# EAGLE design ETAG (EAGLE 8.0.0)

## Sheet 1 of 2
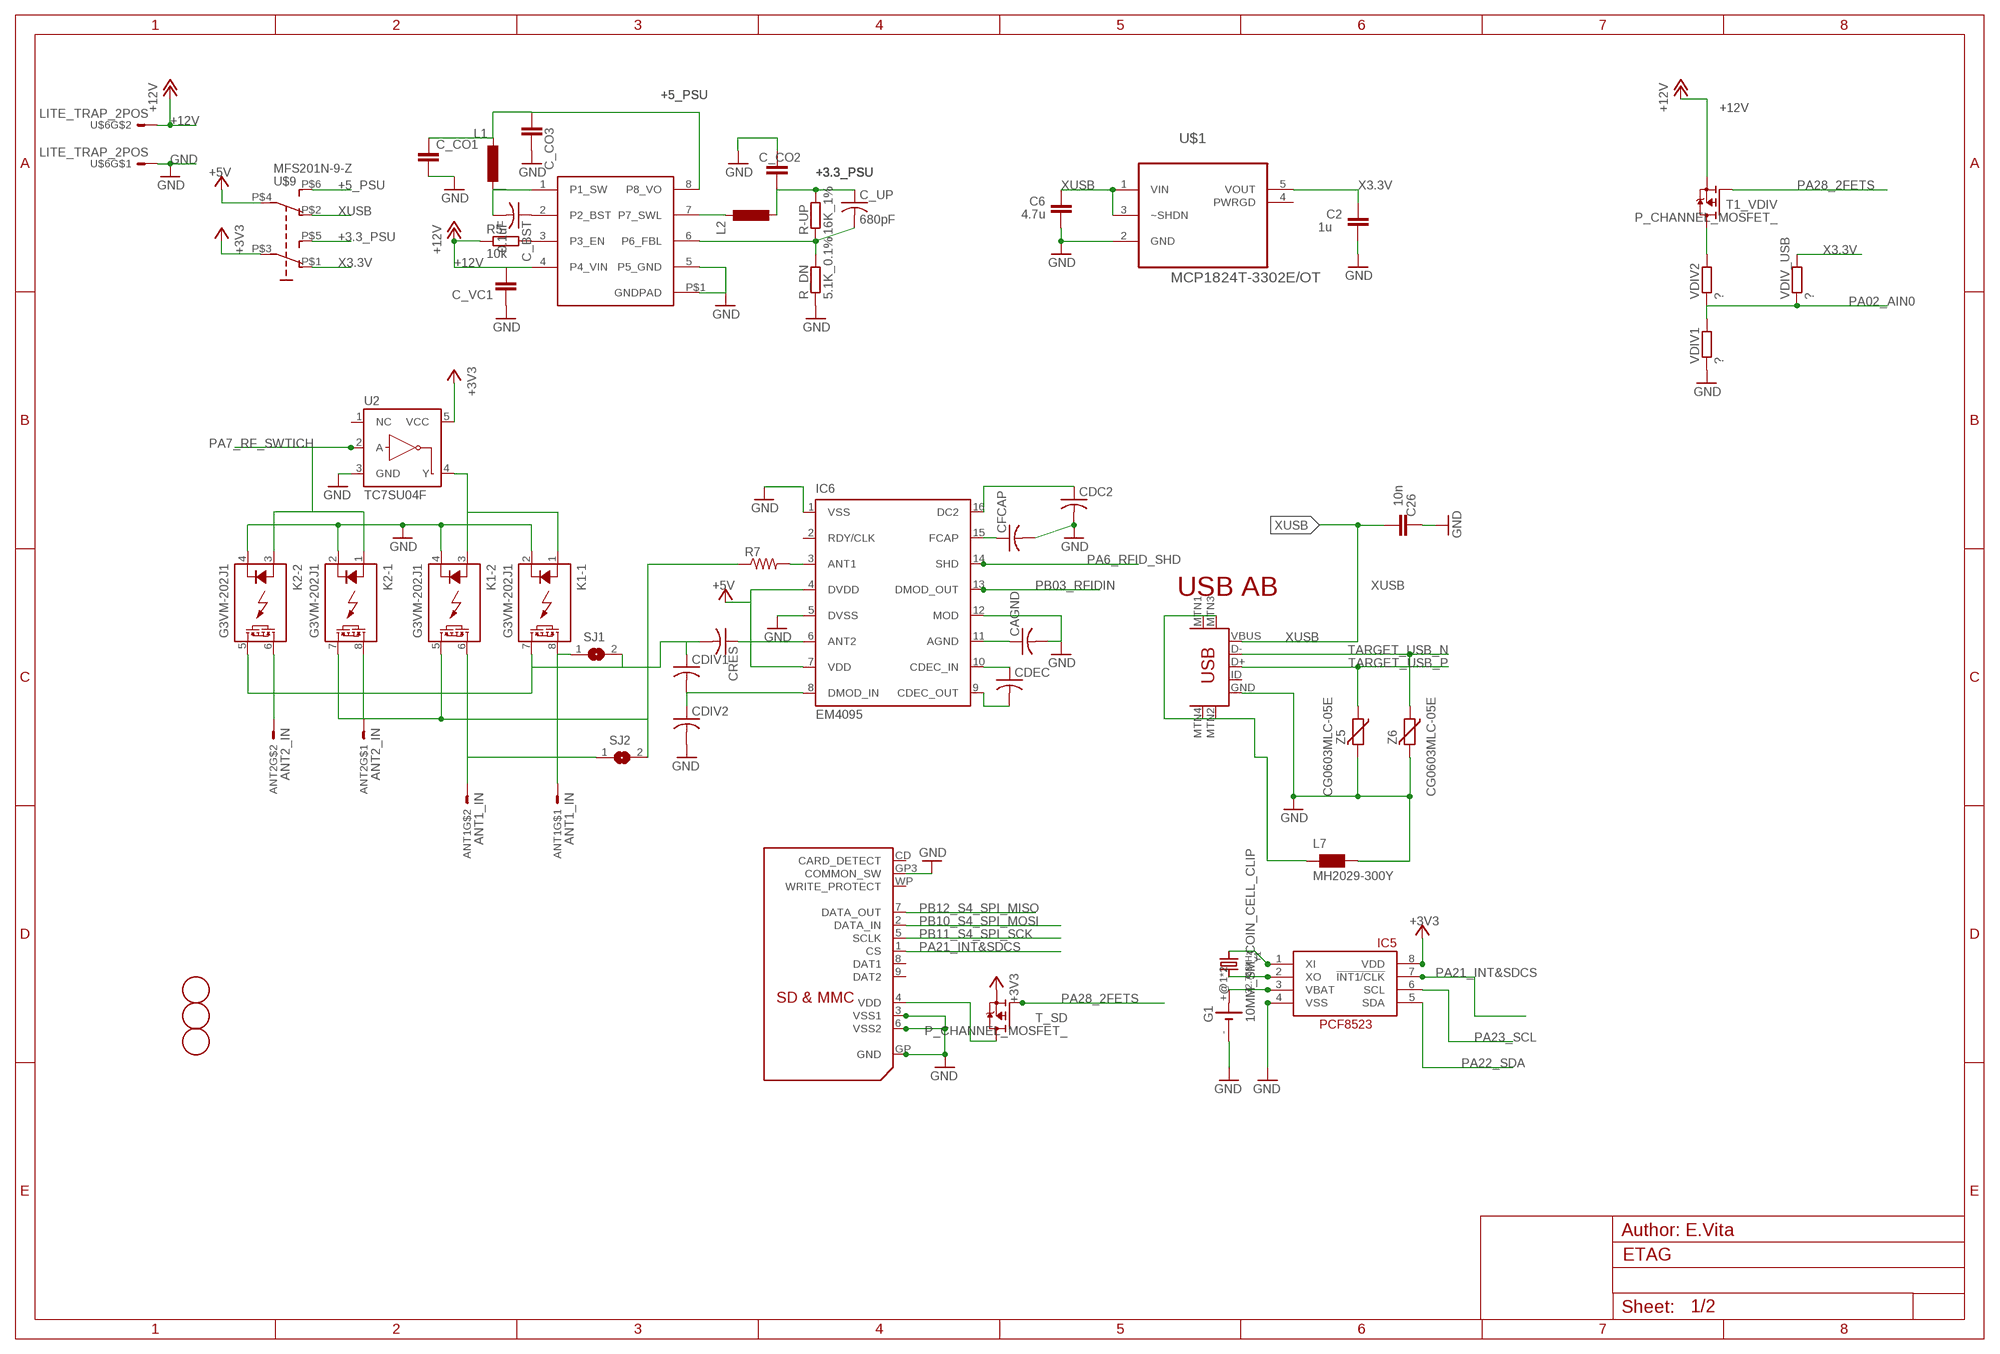
[diagram p0: schematic, sheet 1]

### Parts
ANT1  ANT1_IN  LITE_TRAP_2POS  [LITE_TRAP_MINI]
ANT2  ANT2_IN  LITE_TRAP_2POS  [LITE_TRAP_MINI]
C2  1u  0142_10NF_0603  [C0603-ROUND]
C6  4.7u  0142_10NF_0603  [C0603-ROUND]
C26  10n  0142_10NF_0603  [C0603-ROUND]
C_BST  0.1uF  C-US  [C0603-ROUND]
C_CO1  22uF  C-EUC0805  [C0805]
C_CO2  22uF  C-EUC0805  [C0805]
C_CO3  10uF  C-EUC0805  [C0805]
C_UP  680pF  C-US  [C0603-ROUND]
C_VC1  10uF  C-EUC1210  [C1210]
CAGND  C-US  [C0603-ROUND]
CDC2  C-US  [C0603-ROUND]
CDEC  C-US  [C0603-ROUND]
CDIV1  C-USC1206K  [C1206K]
CDIV2  C-USC1206K  [C1206K]
CFCAP  C-US  [C0603-ROUND]
CRES  C-USC1206K  [C1206K]
FD1  FIDUCIALMOUNT  [FIDUCIA-MOUNT]
FD2  FIDUCIALMOUNT  [FIDUCIA-MOUNT]
FD3  FIDUCIALMOUNT  [FIDUCIA-MOUNT]
G1  10MM_SM_COIN_CELL_CLIP  [10MM_SM_COIN_CELL_CLIP]
IC5  RTC_PCF8523T  [SOIC8_150MIL]
IC6  EM4095  [SO16]
K1  G3VM-202J1  AQW21SOP  [SOP08]
K2  G3VM-202J1  AQW21SOP  [SOP08]
L1  22uH  L-EUSLF_10MM  [SLF10165]
L2  2.2uH  L-EU1008  [L1008(2520METRIC)]
L7  MH2029-300Y  0001_BLM21PG300SN1D_/_MH2029-300Y  [0805]
R5  10k  0028_CR0603JW103L  [R0603-ROUND]
R7  R-US_R1206  [R1206]
R-UP  16K_1%  2022_CR0603FW104L  [R0603-ROUND]
R_DN  5.1K_0.1%  2339_  [R0603-ROUND]
SJ1  SJW  [SJW]
SJ2  SJW  [SJW]
T1_VDIV  P_CHANNEL_MOSFET_  [SOT23]
T_SD  P_CHANNEL_MOSFET_  [SOT23]
U2  TC7SU04F  INVERTER_SOT23-5  [SOT23-5]
U$1  MCP1824T-3302E/OT  [SOT95P270X145-5N]
U$3  BD93291EFJSOP8_W_GND  [SOP08_GNDPAD]
U$4  SDMMC06132  [06132]
U$5  USB-MINIB-5PIN  [USB-MINIB]
U$6  LITE_TRAP_2POS  [LITE_TRAP_MINI]
U$9  MFS201N-9-Z  [MFS201N-9-Z]
VDIV1  ?  2339_  [R0603-ROUND]
VDIV2  ?  2022_CR0603FW104L  [R0603-ROUND]
VDIV_USB  ?  2339_  [R0603-ROUND]
Y1  32.768kHz  CRYSTAL8.0X3.8  [CRYSTAL_8X3.8]
Z5  CG0603MLC-05E  0010_BRNCG0603MLC-05E  [CT/CN0603]
Z6  CG0603MLC-05E  0010_BRNCG0603MLC-05E  [CT/CN0603]

### Nets
2GND [gnd]: L7.1 U$5.MTN1(MTN2) U$5.MTN2(MTN3) U$5.MTN3(MTN1) U$5.MTN4
+3.3_PSU: C_CO2.2 C_UP.1 L2.2 R-UP.2 U$9.P$5(S)
+3V3: IC5.8(VDD) T_SD.2(S) U2.5(VCC) U$9.P$3(P) ; also sheet 2
+5_PSU [usbvcc]: C_CO1.1 C_CO3.1 L1.P$1 U$3.8(P8_VO) U$9.P$6(S1)
+5V [usbvcc]: IC6.4(DVDD) IC6.7(VDD) U$9.P$4(P1) ; also sheet 2
+12V: C_VC1.2 R5.1 T1_VDIV.2(S) U$3.4(P4_VIN) U$6.P$3 U$6.P$4 ; also sheet 2
GND [gnd]: C2.1 C6.1 C26.2 C_CO1.2 C_CO2.1 C_CO3.2 C_VC1.1 CAGND.2 CDC2.2 CDIV2.2 CFCAP.2 G1.- IC5.4(VSS) IC6.1(VSS) IC6.5(DVSS) IC6.12(MOD) K1.2(-1:K) K1.4(-2:K) K2.2(-1:K) K2.4(-2:K) L7.2 R_DN.1 U2.3(GND) U$1.2(GND) U$3.5(P5_GND) U$3.P$1(GNDPAD) U$4.3(VSS1) U$4.6(VSS2) U$4.GP3(COMMON_SW) U$4.GP(GND) U$5.GND U$6.P$1 U$6.P$2 VDIV1.1 Z5.2 Z6.2 ; also sheet 2
N$2: IC5.2(XO) Y1.P$4
N$3: IC5.1(XI) Y1.P$1
N$4: CFCAP.1 IC6.15(FCAP)
N$5: CAGND.1 IC6.11(AGND)
N$6: C_BST.1 U$3.2(P2_BST)
N$7: C_UP.2 R-UP.1 R_DN.2 U$3.6(P6_FBL)
N$8: R5.2 U$3.3(P3_EN)
N$9: K1.5(-2:D2) K2.7(-1:D2) R7.1 SJ2.2
N$11: CDIV1.1 CRES.2 K1.7(-1:D2) K2.5(-2:D2) SJ1.2
N$12: CRES.1 IC6.6(ANT2)
N$13: CDIV1.2 CDIV2.1 IC6.8(DMOD_IN)
N$14: ANT1.P$1 ANT1.P$2 K1.8(-1:D1) SJ1.1
N$16: ANT2.P$1 ANT2.P$2 K2.8(-1:D1)
N$17: CDC2.1 IC6.16(DC2)
N$18: CDEC.2 IC6.9(CDEC_OUT)
N$19: CDEC.1 IC6.10(CDEC_IN)
N$20: IC6.3(ANT1) R7.2
N$23: T1_VDIV.3(D) VDIV2.2
N$26: L2.1 U$3.7(P7_SWL)
N$27: C_BST.2 L1.P$2 U$3.1(P1_SW)
N$30: ANT2.P$3 ANT2.P$4 K2.6(-2:D1)
N$32: K1.1(-1:A) K1.3(-2:A) U2.4(Y)
N$35: ANT1.P$3 ANT1.P$4 K1.6(-2:D1) SJ2.1
PA02_AIN0: VDIV1.2 VDIV2.1 VDIV_USB.1 ; also sheet 2
PA6_RFID_SHD: IC6.14(SHD)
PA7_RF_SWTICH: K2.1(-1:A) K2.3(-2:A) U2.2(A) ; also sheet 2
PA21_INT&SDCS: IC5.7(!INT1/CLK) U$4.1(CS) ; also sheet 2
PA22_SDA: IC5.5(SDA) ; also sheet 2
PA23_SCL: IC5.6(SCL) ; also sheet 2
PA28_2FETS: T1_VDIV.1(G) T_SD.1(G) ; also sheet 2
PB03_RFIDIN: IC6.13(DMOD_OUT) ; also sheet 2
PB10_S4_SPI_MOSI: U$4.2(DATA_IN) ; also sheet 2
PB11_S4_SPI_SCK: U$4.5(SCLK) ; also sheet 2
PB12_S4_SPI_MISO: U$4.7(DATA_OUT) ; also sheet 2
TARGET_USB_N [USBpair]: U$5.D- Z6.1 ; also sheet 2
TARGET_USB_P [USBpair]: U$5.D+ Z5.1 ; also sheet 2
VBAT1: G1.+@1(+) G1.+@2(+) IC5.3(VBAT)
VDD: T_SD.3(D) U$4.4(VDD)
X3.3V: C2.2 U$1.5(VOUT) U$9.P$1(O) VDIV_USB.2
XUSB [usbvcc]: C6.2 C26.1 U$1.1(VIN) U$1.3(~SHDN) U$5.VBUS U$9.P$2(O1)
Unconnected: IC6.2(RDY/CLK) U2.1(NC) U$1.4(PWRGD) U$4.8(DAT1) U$4.9(DAT2) U$4.CD(CARD_DETECT) U$4.WP(WRITE_PROTECT) U$5.ID

### Notes on the sheet
- USB AB
- Author: E.Vita

## Sheet 2 of 2
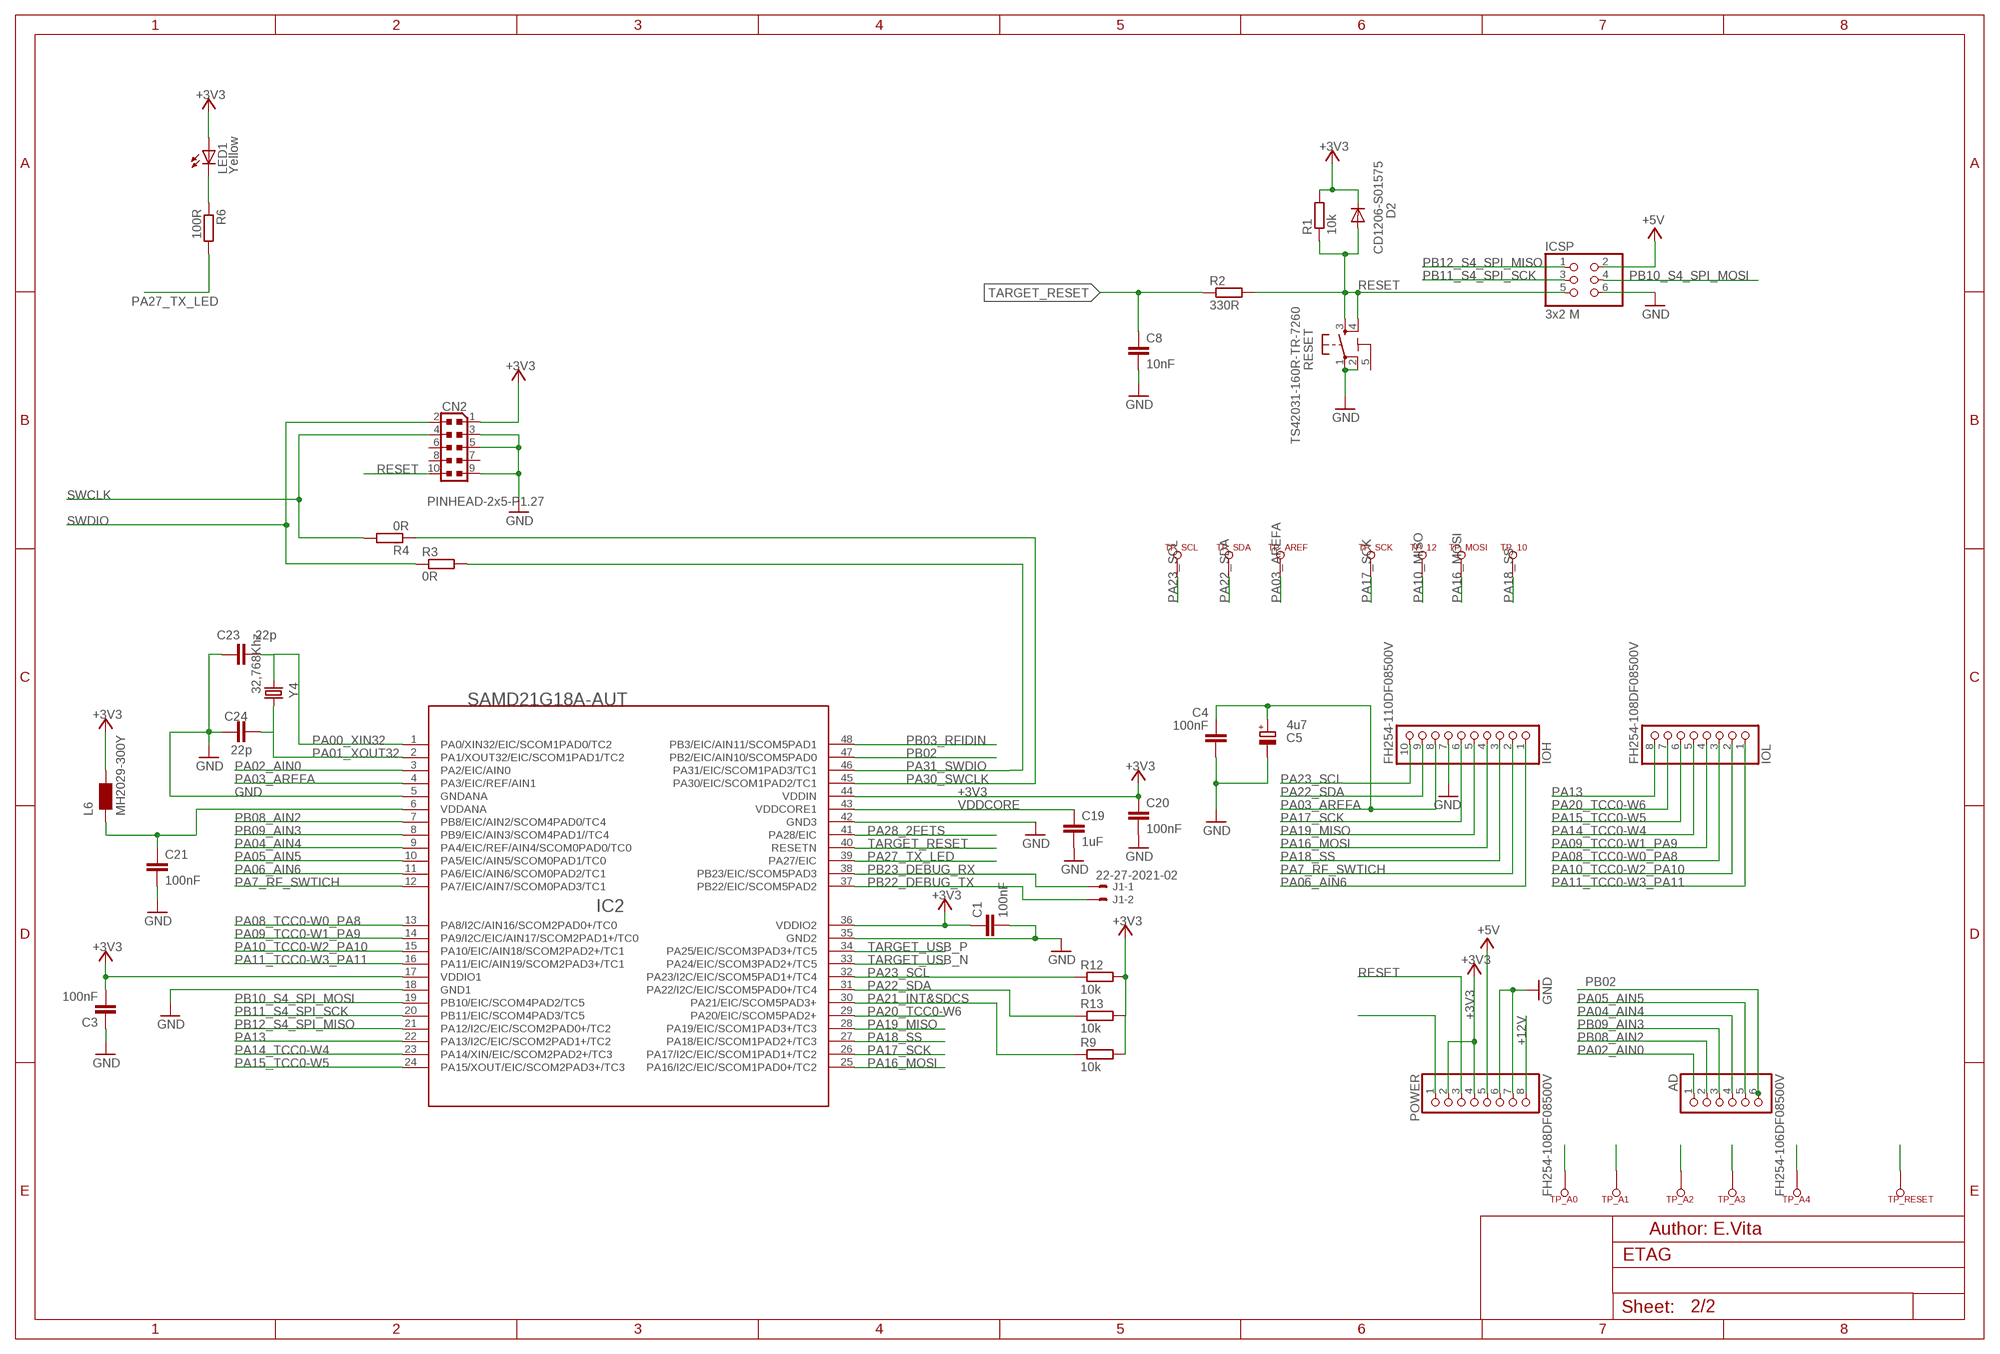
[diagram p1: schematic, sheet 2]

### Parts
AD  FH254-106DF08500V  1682_20TW-535_STD  [1X06]
C1  100nF  0015_100NF_0603  [C0603-ROUND]
C3  100nF  0015_100NF_0603  [C0603-ROUND]
C4  100nF  0015_100NF_0603  [C0603-ROUND]
C5  4u7  0474_TAJA475M016RNJ  [SMC_A]
C8  10nF  0142_10NF_0603  [C0603-ROUND]
C19  1uF  0006_1UF_0603/GRM188R61E105KA12D  [C0603-ROUND]
C20  100nF  0015_100NF_0603  [C0603-ROUND]
C21  100nF  0015_100NF_0603  [C0603-ROUND]
C23  22p  0014_22PF_0603  [C0603-ROUND]
C24  22p  0014_22PF_0603  [C0603-ROUND]
CN2  PINHEAD-2x5-P1.27  0171_PH127-205DF055G00AROUND-PADS  [PINHEAD_2X05_127]
D2  CD1206-S01575  0012_CD1206-S01575  [MINIMELF]
IC2  SAMD21G18A-AUT  1792_SAMD21G18A-AUT  [TQFP48-7X7]
ICSP  3x2 M  0114_PH254-203DF118A00V  [2X03]
IOH  FH254-110DF08500V  1684_20TW-537  [1X10]
IOL  FH254-108DF08500V  1683_20TW-536  [1X08]
J1  22-27-2021-02  [6410-02]
L6  MH2029-300Y  0001_BLM21PG300SN1D_/_MH2029-300Y  [0805]
LED1  Yellow  0044_KPT-2012YC  [CHIPLED_0805]
POWER  FH254-108DF08500V  1683_20TW-536  [1X08]
R1  10k  0028_CR0603JW103L  [R0603-ROUND]
R2  330R  0049_330R_0603  [R0603-ROUND]
R3  0R  0233_0R_0603  [R0603-ROUND]
R4  0R  0233_0R_0603  [R0603-ROUND]
R6  100R  0233_0R_0603  [R0603-ROUND]
R9  10k  0028_CR0603JW103L  [R0603-ROUND]
R12  10k  0028_CR0603JW103L  [R0603-ROUND]
R13  10k  0028_CR0603JW103L  [R0603-ROUND]
RESET  TS42031-160R-TR-7260  0946_TS42031-160W-TR-7260  [TS42]
TP_10  TP_SP  [TP-SP]
TP_12  TP_SP  [TP-SP]
TP_A0  TP_SP  [TP-SP]
TP_A1  TP_SP  [TP-SP]
TP_A2  TP_SP  [TP-SP]
TP_A3  TP_SP  [TP-SP]
TP_A4  TP_SP  [TP-SP]
TP_AREF  TP_SP  [TP-SP]
TP_MOSI  TP_SP  [TP-SP]
TP_RESET  TP_SP  [TP-SP]
TP_SCK  TP_SP  [TP-SP]
TP_SCL  TP_SP  [TP-SP]
TP_SDA  TP_SP  [TP-SP]
Y4  32,768Khz  0213_ABS07-32.768KHZ-T  [RESONATOR_EPSON_FC_145]

### Nets
+3V3: C1.1 C3.2 C20.1 CN2.1 D2.C IC2.17(VDDIO1) IC2.36(VDDIO2) IC2.44(VDDIN) L6.2 LED1.A POWER.2 POWER.4 R1.2 R9.2 R12.2 R13.2 ; also sheet 1
+5V [usbvcc]: ICSP.2 POWER.5 ; also sheet 1
+12V: POWER.8 ; also sheet 1
GND [gnd]: C1.2 C3.1 C4.2 C5.- C8.2 C19.2 C20.2 C21.2 C23.1 C24.1 CN2.3 CN2.5 CN2.9 IC2.5(GNDANA) IC2.18(GND1) IC2.35(GND2) IC2.42(GND3) ICSP.6 IOH.7 POWER.6 POWER.7 RESET.1 RESET.2 ; also sheet 1
N$1: LED1.C R6.1
N$10: C21.1 IC2.6(VDDANA) L6.1
N$56: POWER.1
PA00_XIN32: C23.2 IC2.1(PA0/XIN32/EIC/SCOM1PAD0/TC2) Y4.P$1
PA01_XOUT32: C24.2 IC2.2(PA1/XOUT32/EIC/SCOM1PAD1/TC2) Y4.P$2
PA02_AIN0: AD.1 IC2.3(PA2/EIC/AIN0) TP_A0.X(TESTP) ; also sheet 1
PA03_AREFA: C4.1 C5.+ IC2.4(PA3/EIC/REF/AIN1) IOH.8 TP_AREF.X(TESTP)
PA04_AIN4: AD.4 IC2.9(PA4/EIC/REF/AIN4/SCOM0PAD0/TC0) TP_A3.X(TESTP)
PA05_AIN5: AD.5 IC2.10(PA5/EIC/AIN5/SCOM0PAD1/TC0) TP_A4.X(TESTP)
PA06_AIN6: IC2.11(PA6/EIC/AIN6/SCOM0PAD2/TC1) IOH.1
PA7_RF_SWTICH: IC2.12(PA7/EIC/AIN7/SCOM0PAD3/TC1) IOH.2 ; also sheet 1
PA08_TCC0-W0_PA8: IC2.13(PA8/I2C/AIN16/SCOM2PAD0+/TC0) IOL.3
PA09_TCC0-W1_PA9: IC2.14(PA9/I2C/EIC/AIN17/SCOM2PAD1+/TC0) IOL.4
PA10_MISO: TP_12.X(TESTP)
PA10_TCC0-W2_PA10: IC2.15(PA10/EIC/AIN18/SCOM2PAD2+/TC1) IOL.2
PA11_TCC0-W3_PA11: IC2.16(PA11/EIC/AIN19/SCOM2PAD3+/TC1) IOL.1
PA13: IC2.22(PA13/I2C/EIC/SCOM2PAD1+/TC2) IOL.8
PA14_TCC0-W4: IC2.23(PA14/XIN/EIC/SCOM2PAD2+/TC3) IOL.5
PA15_TCC0-W5: IC2.24(PA15/XOUT/EIC/SCOM2PAD3+/TC3) IOL.6
PA16_MOSI: IC2.25(PA16/I2C/EIC/SCOM1PAD0+/TC2) IOH.4 TP_MOSI.X(TESTP)
PA17_SCK: IC2.26(PA17/I2C/EIC/SCOM1PAD1+/TC2) IOH.6 TP_SCK.X(TESTP)
PA18_SS: IC2.27(PA18/EIC/SCOM1PAD2+/TC3) IOH.3 TP_10.X(TESTP)
PA19_MISO: IC2.28(PA19/EIC/SCOM1PAD3+/TC3) IOH.5
PA20_TCC0-W6: IC2.29(PA20/EIC/SCOM5PAD2+) IOL.7
PA21_INT&SDCS: IC2.30(PA21/EIC/SCOM5PAD3+) R9.1 ; also sheet 1
PA22_SDA: IC2.31(PA22/I2C/EIC/SCOM5PAD0+/TC4) IOH.9 R13.1 TP_SDA.X(TESTP) ; also sheet 1
PA23_SCL: IC2.32(PA23/I2C/EIC/SCOM5PAD1+/TC4) IOH.10 R12.1 TP_SCL.X(TESTP) ; also sheet 1
PA27_TX_LED: IC2.39(PA27/EIC) R6.2
PA28_2FETS: IC2.41(PA28/EIC) ; also sheet 1
PA30_SWCLK: IC2.45(PA30/EIC/SCOM1PAD2/TC1) R4.1
PA31_SWDIO: IC2.46(PA31/EIC/SCOM1PAD3/TC1) R3.2
PB02: AD.6 IC2.47(PB2/EIC/AIN10/SCOM5PAD0)
PB03_RFIDIN: IC2.48(PB3/EIC/AIN11/SCOM5PAD1) ; also sheet 1
PB08_AIN2: AD.2 IC2.7(PB8/EIC/AIN2/SCOM4PAD0/TC4) TP_A1.X(TESTP)
PB09_AIN3: AD.3 IC2.8(PB9/EIC/AIN3/SCOM4PAD1//TC4) TP_A2.X(TESTP)
PB10_S4_SPI_MOSI: IC2.19(PB10/EIC/SCOM4PAD2/TC5) ICSP.4 ; also sheet 1
PB11_S4_SPI_SCK: IC2.20(PB11/EIC/SCOM4PAD3/TC5) ICSP.3 ; also sheet 1
PB12_S4_SPI_MISO: IC2.21(PA12/I2C/EIC/SCOM2PAD0+/TC2) ICSP.1 ; also sheet 1
PB22_DEBUG_TX: IC2.37(PB22/EIC/SCOM5PAD2) J1.2
PB23_DEBUG_RX: IC2.38(PB23/EIC/SCOM5PAD3) J1.1
RESET: CN2.10 D2.A ICSP.5 POWER.3 R1.1 R2.2 RESET.3 RESET.4 TP_RESET.X(TESTP)
SWCLK: CN2.4 R4.2
SWDIO: CN2.2 R3.1
TARGET_RESET: C8.1 IC2.40(RESETN) R2.1
TARGET_USB_N [USBpair]: IC2.33(PA24/EIC/SCOM3PAD2+/TC5) ; also sheet 1
TARGET_USB_P [USBpair]: IC2.34(PA25/EIC/SCOM3PAD3+/TC5) ; also sheet 1
VDDCORE: C19.1 IC2.43(VDDCORE1)
Unconnected: CN2.6 CN2.7 CN2.8

### Notes on the sheet
- Author: E.Vita

## Power pins joined to a net without a drawn wire
5-GND: RESET.5(5-GND)

## Library data of the parts
AD = Connettori:1682_20TW-535: Female Gray Connector strip for Arduino 3V3 bases - 6x1 F V h 8,5 p2,54; MONTHLY_USAGE: 86722.85; PART_NUMBER: 20TW-535; PRICE: _0.03; SUPPLIER: CBC_elettronica__s.r.l.; TYPE: Connettori
ANT1 ANT2 U$6 = con-molex:LITE_TRAP_2POS
C1 C3 C4 C20 C21 = Condensatori:0015_100NF_0603: 100nF 0603 50V; CASE: 0603; MONTHLY_USAGE: _____; PART_NUMBER: cl10b104kbnc; PRICE: _____; SUPPLIER: _____; TYPE: Condensatori
C2 C6 C26 = Condensatori:0142_10NF_0603: 10nF 0603; CASE: 0603; MONTHLY_USAGE: _____; PART_NUMBER: 10nF_0603; PRICE: _____; SUPPLIER: _____; TYPE: Condensatori; VALUE: 10nF
C5 = Condensatori:0474_TAJA475M016RNJ: 4u7 tantalio Case A - testa gialla -Tantalio; CASE: CaseA_(1206); MONTHLY_USAGE: _____; PART_NUMBER: TAJA475M016RNJ; PRICE: _____; SUPPLIER: _____; TYPE: Condensatori
C8 = Condensatori:0142_10NF_0603: 10nF 0603; CASE: 0603; MONTHLY_USAGE: _____; PART_NUMBER: 10nF_0603; PRICE: _____; SUPPLIER: _____; TYPE: Condensatori
C19 = Condensatori:0006_1UF_0603/GRM188R61E105KA12D: 1uF 0603; CASE: 0603; MONTHLY_USAGE: _____; PART_NUMBER: 1uF_0603/GRM188R61E105KA12D; PRICE: _____; SUPPLIER: _____; TYPE: Condensatori
C23 C24 = Condensatori:0014_22PF_0603: 22pF 0603; CASE: 0603; MONTHLY_USAGE: _____; PART_NUMBER: 22pF_0603; PRICE: _____; SUPPLIER: _____; TYPE: Condensatori
C_BST C_UP CAGND CDC2 CDEC CDIV1 CDIV2 CFCAP CRES = rcl:C-US: CAPACITOR, American symbol
C_CO1-C_CO3 C_VC1 = rcl:C-EU: CAPACITOR, European symbol
CN2 = Connettori:0171_PH127-205DF055G00A: 2x5 PASSO 1,27
D2 = Diodi:0012_CD1206-S01575: small-signal high-speed Switching Diodes CD1206; CASE: 1206; MONTHLY_USAGE: _____; PART_NUMBER: CD1206-S01575; PRICE: _____; SUPPLIER: _____; TYPE: Diodi
FD1-FD3 = SmartPrj:FIDUCIALMOUNT
G1 = battery:10MM_SM_COIN_CELL_CLIP: Battery cell clip for CR927 Source: KEYSTONE ELECTRONICS CORP. www.keyelco.com, ASTORIA, N.Y. 11105-2017 PART ANME 10mm SM COIN CELl CLIP DWG NO. 3030
IC2 = IntegratedCircuits:1792_SAMD21G18A-AUT: Atmel D21 32bit ARM Cortex-M0 microcontroller - 48 PIN TQFP 256KB flash memory + 32KB SRAM
IC5 = microbuilder:RTC_PCF8523
IC6 = em-microelectronic:EM4095: Read/Write analog front end for 125kHz RFID Basestation Source: http://www.emmicroelectronic.com/webfiles/Product/RFID/DS/EM4095_DS.pdf
ICSP = Connettori:0114_PH254-203DF118A00V: 3x2 M V h 8,5 mm p2,54; MONTHLY_USAGE: _____; PART_NUMBER: PH254-203DF118A00V; PRICE: _____; SUPPLIER: _____; TYPE: Connettori; VALUE: ICSP
IOH = Connettori:1684_20TW-537: Female Gray Connector strip for Arduino 3V3 bases - 10x1 F V h 8,5 p2,54mm; MONTHLY_USAGE: _____; PART_NUMBER: 20TW-537; PRICE: _____; SUPPLIER: _____; TYPE: Connettori
IOL POWER = Connettori:1683_20TW-536: Female Gray Connector strip for Arduino 3V3 bases - 8x1 F V h 8,5 p2,54mm; MONTHLY_USAGE: _____; PART_NUMBER: 20TW-536; PRICE: _____; SUPPLIER: _____; TYPE: Connettori
J1 = con-molex:22-?-02: CONNECTOR wire to board 2.54 mm (.1 inch) pitch header; OC_FARNELL: unknown; OC_NEWARK: unknown
K1 K2 = relay:AQW*: PhotoMOS Relay NAiS Source: http://www.mew-europe.com/.. pti_en.pdf; OC_FARNELL: unknown; OC_NEWARK: unknown
L1 L2 = rcl:L-EU: INDUCTOR, European symbol
L6 L7 = Protezione:0001_BLM21PG300SN1D_/_MH2029-300Y: BLM21; MONTHLY_USAGE: _____; PART_NUMBER: BLM21PG300SN1D_/_MH2029-300Y; PRICE: _____; SUPPLIER: _____; TYPE: Protezione
LED1 = Opto:0044_KPT-2012YC: LED YELLOW - SMD - 0805; MONTHLY_USAGE: _____; PART_NUMBER: KPT-2012YC; PRICE: _____; SUPPLIER: _____; TYPE: Opto
R1 R5 R9 R12 R13 = Resistenze:0028_CR0603JW103L: 10K 0603; CASE: 0603; MONTHLY_USAGE: _____; PART_NUMBER: CR0603JW103L; PRICE: _____; SUPPLIER: _____; TYPE: Resistenze
R2 = Resistenze:0049_330R_0603: 330R 0603; CASE: 0603; MONTHLY_USAGE: _____; PART_NUMBER: 330R_0603; PRICE: _____; SUPPLIER: _____; TYPE: Resistenze
R3 R4 = Resistenze:0233_0R_0603: 0R 0603; CASE: 0603; MONTHLY_USAGE: _____; PART_NUMBER: 0R_0603; PRICE: _____; SUPPLIER: _____; TYPE: Resistenze
R6 = Resistenze:0233_0R_0603: 0R 0603; CASE: 0603; MONTHLY_USAGE: _____; PART_NUMBER: 0R_0603; PRICE: _____; SUPPLIER: _____; TYPE: Resistenze; VALUE: 0R
R7 = rcl:R-US_: RESISTOR, American symbol
R-UP VDIV2 = Resistenze:2022_CR0603FW104L: 0603 Resistor 100K 1%; PART_NUMBER: CR0603FW104L; VALUE: 100K_1%
R_DN VDIV1 VDIV_USB = Resistenze:2339_: 19K1 0,1% 0603; CASE: 0603; MONTHLY_USAGE: _____; PRICE: _____; SUPPLIER: _____; TYPE: Resistenze; VALUE: 19K1_0,1%
RESET = Switches:0946_TS42031-160W-TR-7260: Pushbutton 6x6 Smd - White; MONTHLY_USAGE: _____; PART_NUMBER: IT-1157AHNP-160G-G_GTR; PRICE: _____; SUPPLIER: _____; TYPE: Switches; VALUE: TS42
SJ1 SJ2 = jumper:SJ: SMD solder JUMPER
T1_VDIV T_SD = transistor-fet:P_CHANNEL_MOSFET_
TP_10 TP_12 TP_A0 TP_A1-TP_A4 TP_AREF TP_MOSI TP_RESET TP_SCK TP_SCL TP_SDA = SmartPrj:TP_SP
U2 = SparkFun-DigitalIC:INVERTER: Single inverter, SOT23-5; NOTE: RETIRED; PROD_ID: 8211
U$1 = Microchip_By_element14_Batch_1:MCP1824T-3302E/OT: 300 mA, Low Voltage, Low Quiescent Current LDO Regulator; MPN: MCP1824T-3302E/OT; OC_FARNELL: 1578387; OC_NEWARK: 40M0704; PACKAGE: SOT23-5; SUPPLIER: Microchip
U$3 = v-reg:BD93291EFJ: BD93291EFJ Voltage regulator
U$4 = microbuilder:SDMMC: SD MMC Card holder 4UCON part #06132 - easy to solder
U$5 = USB_miniB:USB-MINIB
U$9 = switch:MFS201N-9-Z
Y1 = microbuilder:CRYSTAL: Crystals HC49UP - Surface Mount Crystal 4.0MHz 18pF +/-30ppm Surface Mount Crystal [Digikey: 535-9857-1-ND] 12.0 MHz Surface Mount Crystal [Digikey: 535-9869-6-ND] 25.0 MHz Surface Mount Crystal [Digikey: 535-9078-1-ND] 2.5 x 2.0mm - MEMs SMT Crystal 16.0 MHz 10pF 20ppm 2.5 x 2.0mm Crystal [Digikey -40-85°C: 535-10923-1-ND] 3.2 x 2.5mm - MEMs SMT Crystal 12.0 MHz 8pF 15ppm 3.2 x 2.5mm Crystal [Digikey: -10-70°C: 644-1047-1-ND -40-125°C: 644-1128-1-ND] 40~85°C cheaper: 644-1173-6-ND 16.0 MHz 8pF 15ppm 3.2 x 2.5mm Crystal [Digikey: -10-70°C: 644-1049-1-ND -40-125°C: 644-1129-2-ND]-40~85°C cheaper: 644-1175-6-ND 16.0 MHz 10pF 10ppm 3.2 x 2.5mm Crystal [Digikey: 644-1100-1-ND] 27.12 MHz 18pF 30ppm 3.2 x 2.5mm Crystal [Digikey: 887-1424-1-ND] 27.12MHz 10pF 10ppm 3.2 x 2.5mm Crystal [Digikey: 887-1329-1-ND] 4.9 x 1.8mm - MEMs SMT Crystal 32.768 KHz 12.5pF 20ppm 4.9 x 1.8mm Crystal [Digikey: SE2415CT-ND] 8.0 x 3.8mm - Surface Mount Crystal 32.768kHz 12.5pF 20ppm -40°C-85°C [Digikey: 535-9166-2-ND] Cylinder 32.768KHz Cylinder Crystal (2x6mm body) [Ex. Digikey: 300-8341-2-ND]
Y4 = Cristalli:0213_ABS07-32.768KHZ-T: 32,768KHz - SMD; MONTHLY_USAGE: _____; PART_NUMBER: ABS07-32.768KHZ-T; PRICE: _____; SUPPLIER: _____; TYPE: Cristalli; VALUE: 32,768Khz_SMD
Z5 Z6 = Protezione:0010_BRNCG0603MLC-05E: CG0603MLC-05E; MONTHLY_USAGE: _____; PART_NUMBER: BRNCG0603MLC-05E; PRICE: _____; SUPPLIER: _____; TYPE: Protezione; VALUE: BRNCG0603MLC-05E

## Net classes
1 USB: width 0.203 mm, drill 0.305 mm, clearance 0.178 mm
2 gnd: width 0.254 mm, drill 0.254 mm, clearance 0.178 mm
3 usbvcc: width 0.203 mm, drill 0.406 mm, clearance 0.178 mm
4 USBpair: width 0.254 mm, drill 0.406 mm, clearance 0.406 mm

## Board
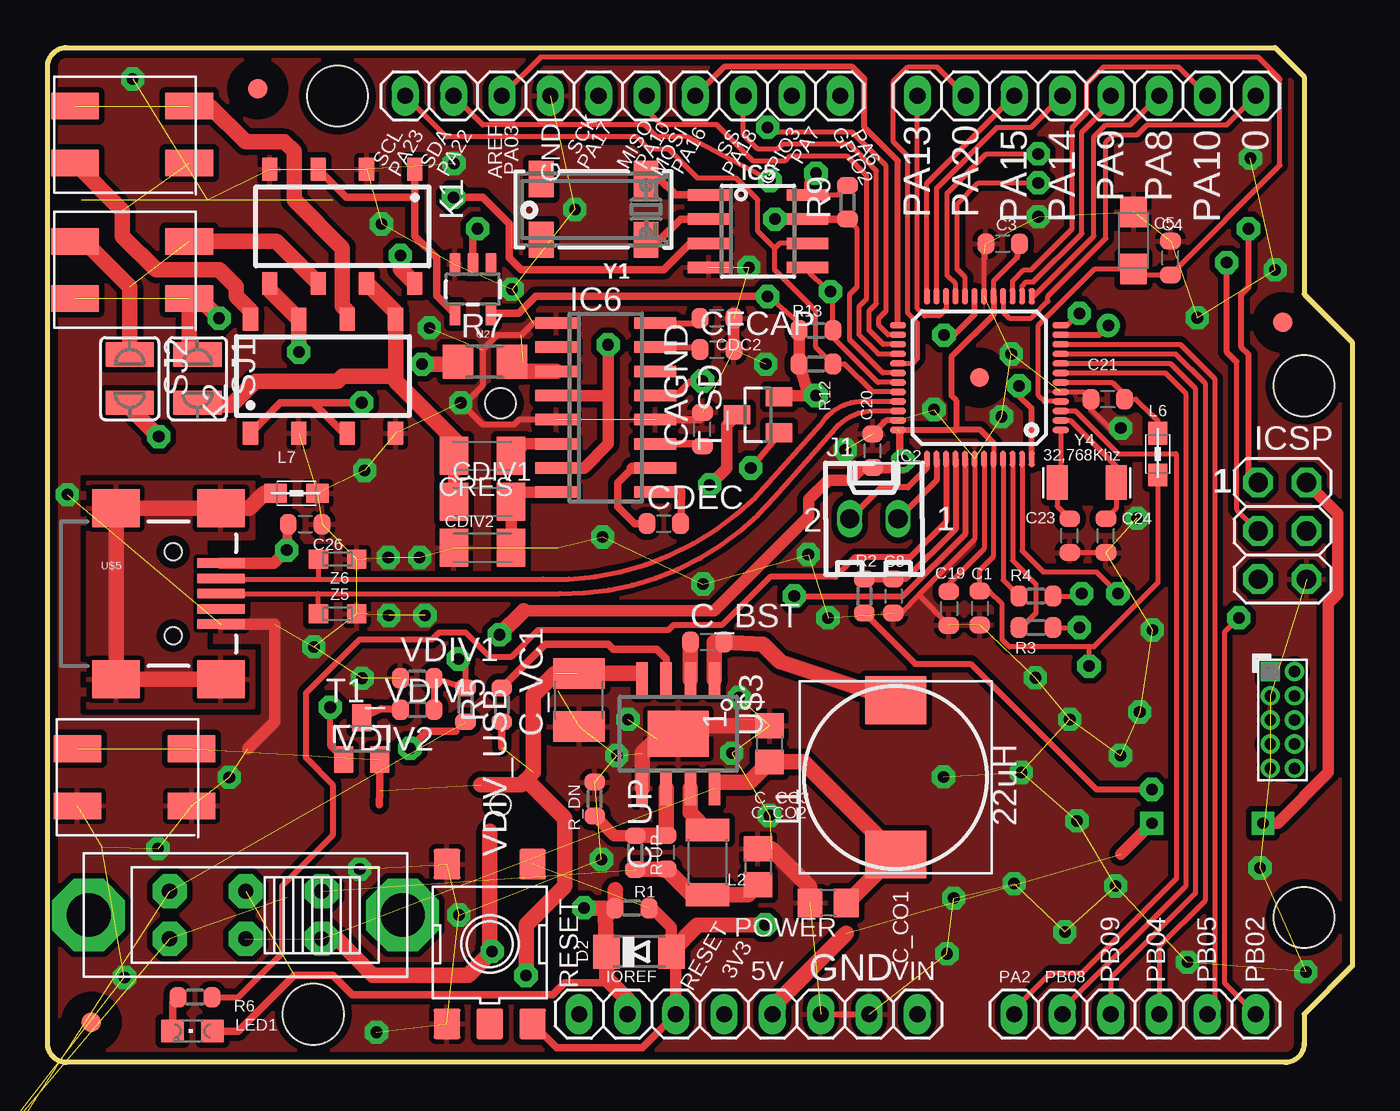
[diagram p2: board, top side]
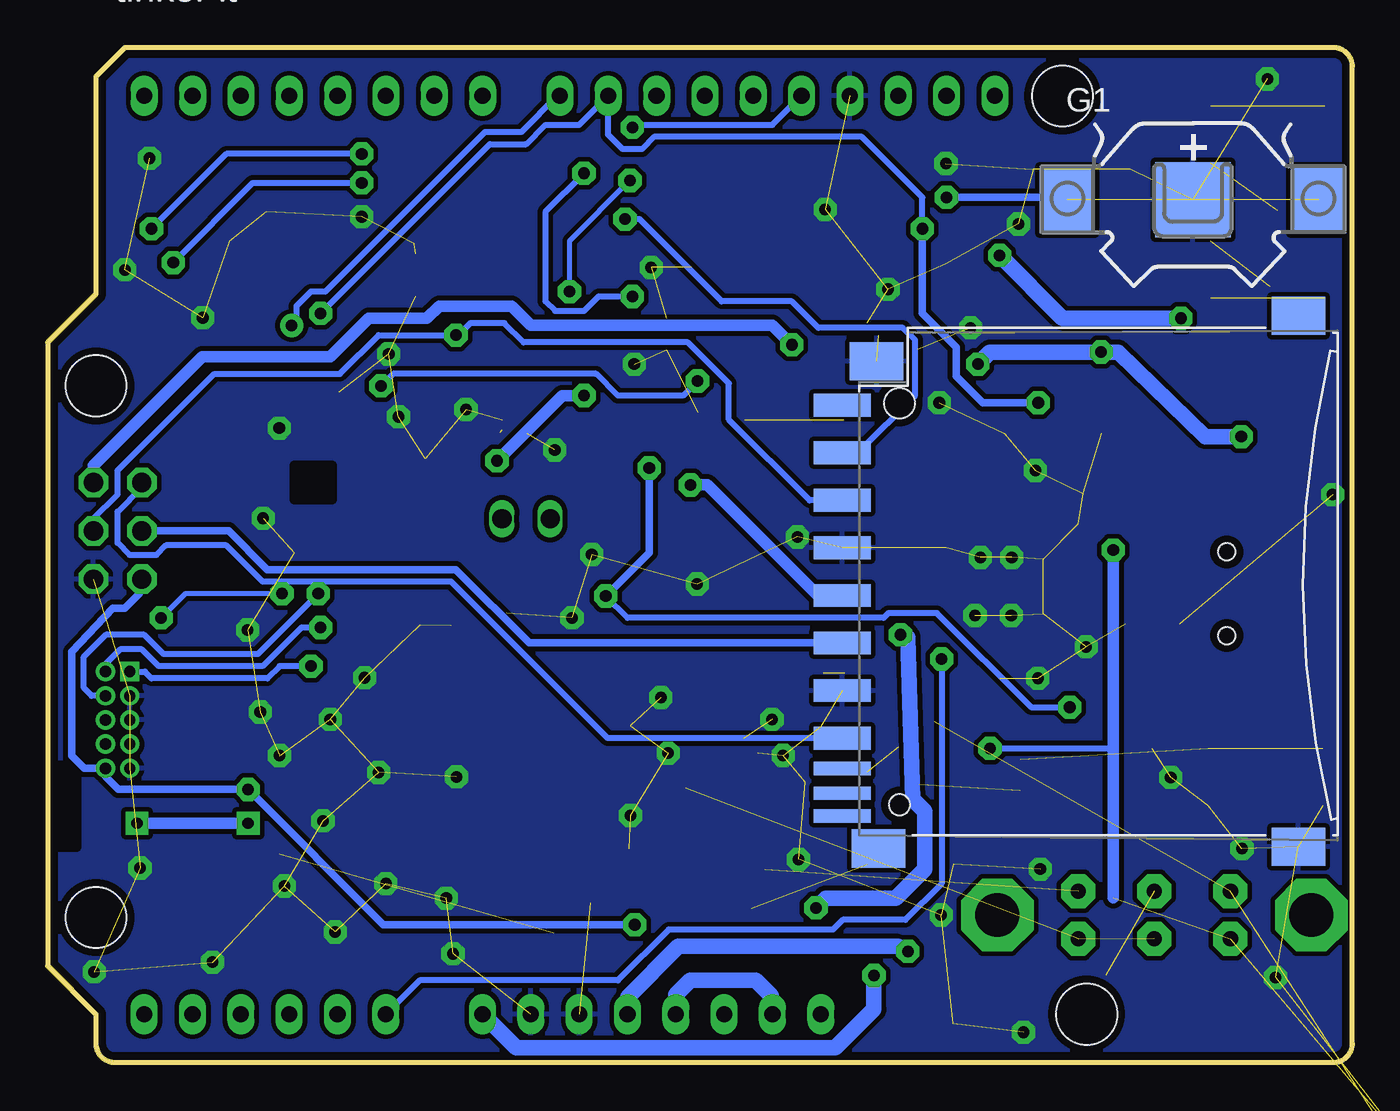
[diagram p3: board, bottom side, seen from below]

Size 68.58 x 53.34 mm. Coordinates in mm from the lower left corner, seen from the top.
Outline: 64.52,53.34 66.04,51.82 66.04,40.39 68.58,37.85 68.58,5.08 66.04,2.54 66.04,1 arc-90 65.04,0 1,0 arc-90 0,1 0,52.34 arc-90 1,53.34 64.52,53.34
Copper layers (1*2+15*16): Top 0.035mm / dielectric 0.5mm / Route2 0.035mm / dielectric 0.4mm / Ground 0.035mm / dielectric 0.5mm / Bottom 0.035mm
Design rules "ArduinoUno *": minimum track width 6mil, minimum drill 16mil, track to track 8mil, track to pad 8mil, pad to pad 4mil, via to via 8mil, smd to smd 4mil, copper to edge 16mil, drill to drill 10mil, minimum pad ring 6mil, minimum via ring 4.5mil, stop-mask expansion 1mil, vias tented up to drill 32mil, thermal gap 10mil
Holes 3.2 mm at 66.04,35.56 66.04,7.62 15.24,50.8 13.97,2.54
bRestrict: area 67.1,11.3 to 68.8,15.6
vRestrict: area 42.2,47.2 to 43.3,48.8; area 48.3,47.5 to 49.5,48.9; area 47.6,47.4 to 48.8,48.9; area 50.2,47.4 to 51.3,48.9; area 44.7,47.2 to 45.8,48.8

### Footprints (pad centres in the part's own frame; a part is rotated, then mirrored left to right if it is on the bottom)
1X06 = drill 0.85 pad 1.422 long: 1 -6.35,0; 2 -3.81,0; 3 -1.27,0; 4 1.27,0; 5 3.81,0; 6 6.35,0
LITE_TRAP_MINI = smd 2.5 x 1.4: P$1 -3,1.5; P$2 3,1.5; P$3 -3,-1.5; P$4 3,-1.5
C0603-ROUND = smd 0.898 x 1.1: 1 -0.889,0; 2 0.889,0
SMC_A = smd 1.6 x 1.4: + -1.5,0; - 1.5,0
C0805 = smd 1.3 x 1.5: 1 -0.95,0; 2 0.95,0
C1210 = smd 1.6 x 2.7: 1 -1.4,0; 2 1.4,0
C1206K = smd 1.5 x 2: 1 -1.5,0; 2 1.5,0
PINHEAD_2X05_127 = drill 0.6 pad 1.016 square: 1 -0.635,2.54 | drill 0.6 pad 1.016: 2 0.635,2.54; 3 -0.635,1.27; 4 0.635,1.27; 5 -0.635,0; 6 0.635,0; 7 -0.635,-1.27; 8 0.635,-1.27; 9 -0.635,-2.54; 10 0.635,-2.54
MINIMELF = smd 1.4 x 1.8: A 1.7,0; C -1.7,0
FIDUCIA-MOUNT = smd 1.016 x 1.016: P$1 0,0
10MM_SM_COIN_CELL_CLIP = smd 2.9 x 3.5: +@1 -6.6,0; +@2 6.6,0 | smd 3.96 x 3.96: - 0,0
TQFP48-7X7 = smd 0.85 x 0.32: 1 -4.275,2.75; 2 -4.275,2.25; 3 -4.275,1.75; 4 -4.275,1.25; 5 -4.275,0.75; 6 -4.275,0.25; 7 -4.275,-0.25; 8 -4.275,-0.75; 9 -4.275,-1.25; 10 -4.275,-1.75; 11 -4.275,-2.25; 12 -4.275,-2.75; 25 4.275,-2.75; 26 4.275,-2.25; 27 4.275,-1.75; 28 4.275,-1.25; 29 4.275,-0.75; 30 4.275,-0.25; 31 4.275,0.25; 32 4.275,0.75; 33 4.275,1.25; 34 4.275,1.75; 35 4.275,2.25; 36 4.275,2.75 | smd 0.32 x 0.85: 13 -2.75,-4.275; 14 -2.25,-4.275; 15 -1.75,-4.275; 16 -1.25,-4.275; 17 -0.75,-4.275; 18 -0.25,-4.275; 19 0.25,-4.275; 20 0.75,-4.275; 21 1.25,-4.275; 22 1.75,-4.275; 23 2.25,-4.275; 24 2.75,-4.275; 37 2.75,4.275; 38 2.25,4.275; 39 1.75,4.275; 40 1.25,4.275; 41 0.75,4.275; 42 0.25,4.275; 43 -0.25,4.275; 44 -0.75,4.275; 45 -1.25,4.275; 46 -1.75,4.275; 47 -2.25,4.275; 48 -2.75,4.275 | smd 1 x 1: P$1 0,0
SOIC8_150MIL = smd 0.6 x 2.2: 1 -1.905,-2.6; 2 -0.635,-2.6; 3 0.635,-2.6; 4 1.905,-2.6; 5 1.905,2.6; 6 0.635,2.6; 7 -0.635,2.6; 8 -1.905,2.6
SO16 = smd 0.6 x 2.2: 1 -4.445,-2.6; 2 -3.175,-2.6; 3 -1.905,-2.6; 4 -0.635,-2.6; 5 0.635,-2.6; 6 1.905,-2.6; 7 3.175,-2.6; 8 4.445,-2.6; 9 4.445,2.6; 10 3.175,2.6; 11 1.905,2.6; 12 0.635,2.6; 13 -0.635,2.6; 14 -1.905,2.6; 15 -3.175,2.6; 16 -4.445,2.6
2X03 = drill 1.016 pad 1.55 octagon: 1 -2.54,-1.27; 2 -2.54,1.27; 3 0,-1.27; 4 0,1.27; 5 2.54,-1.27; 6 2.54,1.27
1X10 = drill 0.85 pad 1.422 long: 1 -11.43,0; 2 -8.89,0; 3 -6.35,0; 4 -3.81,0; 5 -1.27,0; 6 1.27,0; 7 3.81,0; 8 6.35,0; 9 8.89,0; 10 11.43,0
1X08 = drill 0.85 pad 1.422 long: 1 -8.89,0; 2 -6.35,0; 3 -3.81,0; 4 -1.27,0; 5 1.27,0; 6 3.81,0; 7 6.35,0; 8 8.89,0
6410-02 = drill 1.016 long: 1 1.27,0; 2 -1.27,0
SOP08 = smd 0.8 x 1.2: 1 -3.81,-3; 2 -1.27,-3; 3 1.27,-3; 4 3.81,-3; 5 3.81,3; 6 1.27,3; 7 -1.27,3; 8 -3.81,3
SLF10165 = smd 2.5 x 3.2: P$1 -4.05,0; P$2 4.05,0
L1008(2520METRIC) = smd 1.2 x 2.3: 1 -1.7,0; 2 1.7,0
0805 = smd 1.2 x 1: 1 -1.1,0; 2 1.1,0
CHIPLED_0805 = smd 1.2 x 1.2: A 0,-1.05; C 0,1.05
R0603-ROUND = smd 0.898 x 1.1: 1 -0.889,0; 2 0.889,0
R1206 = smd 1.6 x 1.803: 1 -1.422,0; 2 1.422,0
TS42 = smd 1.6 x 1.4: 1 -4.2,2.25; 2 4.2,2.25; 3 -4.2,-2.25; 4 4.2,-2.25; 5 -4.2,0
SJW = smd 1.27 x 2.54: 1 -1.27,0; 2 1.27,0
SOT23 = smd 1 x 1.4: 1 -0.95,-1.1; 2 0.95,-1.1; 3 0,1.1
TP-SP = smd 0.8 x 0.8 bottom: X 0,0
SOT23-5 = smd 0.55 x 1.2: 1 -0.95,-1.3; 2 0,-1.3; 3 0.95,-1.3; 4 0.95,1.3; 5 -0.95,1.3
SOT95P270X145-5N = smd 1.321 x 0.559: 1 -1.372,0.94; 2 -1.372,0; 3 -1.372,-0.94; 4 1.372,-0.94; 5 1.372,0.94
SOP08_GNDPAD = smd 0.6 x 1.8: 1 -1.905,-2.85; 2 -0.635,-2.85; 3 0.635,-2.85; 4 1.905,-2.85; 5 1.905,2.85; 6 0.635,2.85; 7 -0.635,2.85; 8 -1.905,2.85 | smd 3.2 x 2.4: P$1 0,0
06132 = smd 1.2 x 3: 1 6.9,0.9; 2 4.4,0.9; 3 1.9,0.9; 4 -0.6,0.9; 5 -3.1,0.9; 6 -5.6,0.9; 7 -8.1,0.9; 9 9.4,0.9 | smd 0.7 x 3: 8 -9.7,0.9; CD -11,0.9; WP -12.2,0.9 | smd 2 x 2.8: GP -13.8,-23.07; GP2 14.1,-23.07; GP3 11.7,-0.9; GP4 -13.9,-1 | hole 1.1: -11.6,-2.1 | hole 1.6: 9.5,-2.1
USB-MINIB = smd 2.5 x 0.5: D+ 2.5,0; D- 2.5,0.8; GND 2.5,-1.6; ID 2.5,-0.8; VBUS 2.5,1.6 | smd 2.5 x 2: MTN1 -3,4.5; MTN2 2.5,4.5; MTN3 -3,-4.5; MTN4 2.5,-4.5 | hole 0.9: 0,2.2; 0,-2.2
MFS201N-9-Z = drill 0.8 pad 1.778 octagon: P$1 -4,1.25; P$2 -4,-1.25; P$3 0,1.25; P$4 0,-1.25; P$5 4,1.25; P$6 4,-1.25 | drill 2.3 pad 3.81 octagon: P$7 -8.25,0; P$8 8.25,0
CRYSTAL_8X3.8 = smd 1.3 x 1.9: P$1 -2.75,-1.6; P$2 2.75,-1.6; P$3 2.75,1.6; P$4 -2.75,1.6
RESONATOR_EPSON_FC_145 = smd 1.1 x 1.8: P$1 -1.55,0; P$2 1.55,0
CT/CN0603 = smd 1 x 1: 1 -1,0; 2 1,0

### Placement (x,y rotation side)
AD  57.15,2.54 0 top
ANT1  4.45,41.66 180 top
ANT2  4.45,48.77 180 top
C1  48.99,23.88 270 top
C2  -15.37,-23.5 0 top  (outside the outline)
C3  50.2,43.03 0 top
C4  59.02,42.28 90 top
C5  57.08,43.2 90 top
C6  -15.37,-28.57 0 top  (outside the outline)
C8  44.45,24.51 270 top
C19  47.37,23.86 270 top
C20  43.37,32.15 90 top
C21  55.72,34.86 180 top
C23  53.72,27.69 90 top
C24  55.63,27.69 90 top
C26  13.54,28.29 0 top
C_BST  34.67,22.1 0 top
C_CO1  41.02,8.38 180 top
C_CO2  37.34,10.29 270 top
C_CO3  37.95,16.74 90 top
C_UP  32.51,11.05 90 top
C_VC1  27.94,19.05 90 top
CAGND  34.42,33.27 90 top
CDC2  35.18,39.12 0 top
CDEC  32.38,28.32 0 top
CDIV1  22.86,29.46 0 top
CDIV2  22.86,27.05 180 top
CFCAP  35.18,37.47 0 top
CN2  64.9,18 0 top
CRES  22.86,31.88 180 top
D2  31.08,5.82 0 top
FD1  11.05,51.18 180 top
FD2  2.31,2.13 0 top
FD3  64.92,38.89 0 top
G1  8.38,45.34 0 bottom
IC2  48.97,35.99 180 top
IC5  37.34,43.69 270 top
IC6  29.34,34.42 270 top
ICSP  64.9,27.94 270 top
IOH  30.23,50.8 180 top
IOL  54.61,50.8 180 top
J1  43.43,28.57 0 top
K1  15.49,43.94 180 top
K2  14.48,36.07 0 top
L1  44.58,14.99 90 top
L2  34.68,10.52 270 top
L6  58.35,31.98 270 top
L7  13.08,29.92 0 top
LED1  7.62,1.65 90 top
POWER  36.83,2.54 0 top
R1  30.71,8.11 180 top
R2  42.93,24.51 270 top
R3  51.94,22.86 180 top
R4  51.94,24.51 0 top
R5  23.88,18.8 90 top
R6  7.75,3.43 0 top
R7  22.99,36.83 0 top
R9  42.04,45.21 90 top
R12  40.39,36.7 180 top
R13  40.39,38.48 180 top
R-UP  30.89,11.03 270 top
R_DN  28.75,13.85 270 top
RESET  23.24,6.22 90 top
SJ1  7.87,35.94 270 top
SJ2  4.32,35.94 270 top
T1_VDIV  16.51,17.02 0 top
T_SD  37.34,34.04 90 top
TP_10  36.58,50.8 0 top
TP_12  31.5,50.8 0 top
TP_A0  50.8,2.54 0 top
TP_A1  53.34,2.54 0 top
TP_A2  55.88,2.54 0 top
TP_A3  58.42,2.54 0 top
TP_A4  60.96,2.54 0 top
TP_AREF  23.88,50.8 0 top
TP_MOSI  34.04,50.8 0 top
TP_RESET  33.02,2.54 0 top
TP_SCK  28.96,50.8 0 top
TP_SCL  18.8,50.8 0 top
TP_SDA  21.34,50.8 0 top
U2  22.35,40.64 180 top
U$1  -10.67,-16.26 0 top  (outside the outline)
U$3  33.15,17.27 180 top
U$4  25.91,25.15 90 bottom
U$5  6.6,24.64 0 top
U$6  4.57,14.99 180 top
U$9  10.41,7.75 0 top
VDIV1  19.43,20.19 0 top
VDIV2  19.43,18.54 180 top
VDIV_USB  21.97,18.8 270 top
Y1  28.7,44.83 180 top
Y4  54.61,30.48 0 top
Z5  15.24,23.58 0 top
Z6  15.24,26.45 0 top

### Tracks (layer width: path | path; a pad name or v marks a point on that pad's centre or on a via)
2GND
  Top 0.813: U$5.MTN4 9.41,20.07 9.27,20.07 9.2,20.14 U$5.MTN3 U$5.MTN1 U$5.MTN2 10.6,29.14 11.38,29.92 L7.1
  pour Top: 2.16,30.48 10.79,30.48 10.79,27.56 8.26,27.56 8.26,21.59 10.79,21.59 10.79,18.67 2.16,18.67
+3.3_PSU  (1 unrouted)
  Top 0.813: C_CO2.2 36.82,8.82 L2.2 33.86,8.82 C_UP.1 30.91,10.16 R-UP.2
+3V3  (via drill 0.61)  (2 unrouted)
  Top 0.127: 49.71,31.73 IC2.44
  Top 0.254: 49.72,32.55 IC2.44 49.72,26.61 48.99,25.88 C1.1 49.5,24.77 50.16,24.11 50.16,22.23 50.55,21.84 54.74,21.84 | IC2.17 49.72,40.58 49.73,40.59 49.73,41.1 50.96,42.33 C3.2 | L6.2 58.35,25.2 54.99,21.84 54.74,21.84 | IC5.8 41.53,45.59 R9.2 | C20.1 43.03,31.39 | v54.74,20.83 54.74,21.84 | R13.2 39.5,38.86 v37.85,40.26
  Top 0.305: 50.96,42.31 C3.2 | IC2.17 49.72,39.31 47.5,37.08 47.5,35.05 47.75,34.8 47.75,33.24 | IC2.36 47.75,33.24 | IC5.8 39.94,46.29 v40.39,46.74 | 49.72,32.55 49.03,33.24 47.75,33.24
  Top 0.406: 44.8,33.12 44.8,31.66 v44.96,31.62 44.98,31.26 | U2.5 23.33,39.37 24.77,39.37 25.65,40.26 v37.85,40.26 | LED1.A 10.03,1.65 12.95,4.57 14.99,4.57 16,3.56 26.54,3.56 27.18,4.19 29.59,4.19 29.72,4.06
  Top 0.61: 30.55,2.61 POWER.2 | R12.2 40.01,35.05 v40.39,35.05 39.09,35.05 T_SD.2 | R12.2 39.5,36.58 | R12.2 R13.2 | 44.98,31.26 C20.1 42.82,31.26 42.16,30.61 41.02,30.61 40.01,29.59 40.01,28.7 35.05,23.75 25.02,23.75
  Top 0.813: 30.55,2.61 30.55,3.23 29.72,4.06 29.38,4.4 D2.C 29.32,7.67 R1.2 | 29.82,9.07 R1.2 | 25.02,23.75 v23.75,22.48 | v28.19,8.13 28.47,8.11 R1.2
  Bottom 0.305: v40.39,46.74 42.42,44.7 42.42,40.01 41.91,39.5 40.39,39.5 39.62,40.26 v37.85,40.26 | CN2.1 63.47,20.54 63.12,20.19 57.02,20.19 56.39,20.83 v54.74,20.83
  Bottom 0.61: 30.55,3.5 30.55,2.61 POWER.2 | v44.96,31.62 41.53,35.05 v40.39,35.05
  Bottom 0.813: POWER.4 35.56,3.56 34.8,4.32 31.37,4.32 30.55,3.5 | v23.75,22.48 23.37,22.35 23.11,13.84 22.48,13.21 22.48,10.16 24,8.64 27.69,8.64 v28.19,8.13
+5_PSU  (1 unrouted)
  Top 0.406: U$3.8 35.31,14.8 35.31,14.73
  Top 0.813: 35.31,14.73 36.89,14.73 C_CO3.1 39.72,15.79 L1.P$1 | 43.56,11.19 43.66,11.18 43.66,11.19 L1.P$1 | C_CO1.1 42.02,8.38 L1.P$1
+5V  (via drill 0.6, 0.61)  (2 unrouted)
  Top 0.406: 23.24,5.97 v23.37,5.84
  Top 0.61: v29.46,37.72 29.46,35.05 | 29.46,35.05 29.46,32.51 28.19,31.24 IC6.7 | IC6.4 29.46,35.05 | v63.88,12.57 64.64,12.57 67.31,15.24 67.31,24.13 67.82,24.64 67.82,28.83 ICSP.2 | 56.4,10.94 v58.04,12.57
  Top 0.813: POWER.5 38.1,2.92 41.97,6.79 | 14.41,6.48 15.24,6.48 17.1,4.57 22.1,4.57 v23.37,5.84 | 23.24,5.97 23.24,12.15
  Bottom 0.61: ICSP.2 66.17,31.37 60.45,37.08 53.72,37.08 51.69,39.12 48.64,39.12 48.01,39.75 44.2,39.75 43.18,38.73 30.48,38.73 v29.46,37.72 | v58.04,12.57 v63.88,12.57
  Bottom 0.813: POWER.5 38.1,3.43 35.43,6.1 23.88,6.1 23.5,5.71 v23.37,5.84
+12V  (via drill 0.61)  (5 unrouted)
  Top 0.406: 17.44,13.55 17.46,14.29 T1_VDIV.2 | 30.86,20.45 31.19,20.12 U$3.4 | R5.1 23.88,16.55
  Top 0.813: 22.78,14.61 24.89,14.61 25.15,14.86 | 25.15,14.86 25.53,15.24 25.53,19.3 26.67,20.45 | v25.15,4.57 25.15,7.24 27.18,9.27 27.18,12.83 25.15,14.86 | C_VC1.2 27.82,20.45 30.86,20.45
  Bottom 0.813: 45.72,2.67 POWER.8 43.94,0.76 27.18,0.76 25.15,2.79 v25.15,4.57
GND  (via drill 0.61)  (103 unrouted)
  Top 0.254: IC2.18 49.22,42.51 | IC2.42 48.72,27.51 45.78,24.57 | 54.17,26.97 C23.1 C24.1 | IC2.5 54.45,35.24 C21.2 54.83,34.32 55.82,33.34 v56.4,33.34 | 45.78,24.57 44.83,23.62 C8.2 | C19.2 47.37,22.99 45.78,24.57
  Top 0.305: POWER.6 POWER.7 | 49.22,42.51 49.23,42.26 | IC2.35 44.07,33.74 C20.2 | IC6.5 24.77,33.78 24.51,33.53 22.86,33.53 v21.72,34.67 21.97,34.67 22.86,35.56 22.86,37.47 23.62,38.23 24.89,38.23 25.53,38.86 IC6.1
  Top 0.406: IC6.12 34.29,33.78 CAGND.2
  Top 0.61: U$5.GND 11.94,23.04 11.94,17.91 10.52,16.49 | CDC2.2 CFCAP.2
  Top 0.813: U$3.5 31.24,16.26 32,17.02 U$3.P$1 33.19,17.69 C_CO3.2 | C_CO1.2 40.07,9.21 38.04,11.24 C_CO2.1
  other vias: 64.52,41.66 53.47,6.86 63.22,47.52 52.07,44.45 63.72,10.22 4.47,51.69 53.72,18.03 41.02,23.37 27.71,44.83 17.29,1.59 37.95,12.98 57.25,28.6 19.56,26.54 17.91,26.54 4.04,4.47 59.91,5.27 29.17,27.62 19.84,23.5 1.04,29.84 5.81,11.24 20.07,38.61 24.41,40.64 36.86,41.78 9.55,14.99 16.54,20.19 14,21.84 29.92,16.13 30.51,18.03 16.41,10.16 36.35,19.18 35.97,16.26 29.11,10.67 47.09,15.01 51.92,20.22 58.06,22.73 34.44,25.15 17.93,23.5 60.43,39.14 66.13,4.76 16.66,31.11 21.36,47.24 17.55,44.07 56.39,16.13 51.18,15.24 57.4,18.41 47.27,5.71 47.62,8.64 56.13,9.27 54.1,12.7 50.8,9.4 21.62,7.75 39.98,26.7 37.74,36.7 41.92,32.19 50.14,33.93 46.58,34.32 50.65,37.24
  pour Bottom (isolate 0.254, rank 2): -4.86,56.52 73.66,55.88 72.01,-1.4 -4.81,-1.27
  pour Top (isolate 0.305, rank 2): -3.3,55.09 72.57,54.48 73.58,-2.54 -3.43,-2.92
N$1
  Top 0.406: LED1.C 6.57,3.14 R6.1
N$2
  Top 0.406: IC5.2 33.27,44.32 32.18,43.23 Y1.P$4
N$3
  Top 0.406: IC5.1 33.02,45.59 32.18,46.43 Y1.P$1
N$4
  Top 0.305: IC6.15 34.16,37.59 CFCAP.1
N$5
  Top 0.406: IC6.11 34.04,32.51 CAGND.1
N$6
  Top 0.813: U$3.2 C_BST.1
N$7
  Top 0.61: R-UP.1 29.79,11.92 R_DN.2
  Top 0.813: R-UP.1 30.91,11.94 C_UP.2 U$3.6
N$8
  Top 0.406: R5.2 26.16,21.97 29.46,21.97 29.72,21.72 32,21.72 32.51,21.21 U$3.3
N$9  (via drill 0.61)
  Top 0.813: v13.21,37.34 K2.7 11.68,40.59 K1.5 | R7.1 21.18,36.7 v19.68,36.7 | SJ2.2 4.32,34.42 v5.84,32.89
  Bottom 0.813: v5.84,32.89 7.75,32.89 12.32,37.34 v13.21,37.34 19.05,37.34 v19.68,36.7
N$10
  Top 0.254: IC2.6 55.95,35.74 56.74,34.96 C21.1 57.2,34.86 58.04,34.04 58.35,33.73 L6.1
N$11
  Top 0.406: 7.87,34.54 SJ1.2
  Top 0.61: CDIV1.1 CRES.2
  Top 0.813: K1.7 18.29,39.42 K2.5 18.29,36.07 | 18.29,36.07 18.29,35.81 21.59,32.51 CRES.2 | 7.87,34.54 9.65,34.54 10.92,35.81 15.24,35.81 15.49,36.07 18.29,36.07
N$12
  Top 0.61: IC6.6 25.12,32.51 CRES.1
N$13
  Top 0.61: CDIV2.1 CDIV1.2 25,29.97 IC6.8
N$14  (via drill 0.61)  (1 unrouted)
  Top 0.813: SJ1.1 7.45,37.54 ANT1.P$1 7.98,40.16 v9.02,39.12 | K1.8 18.54,41.7 v18.54,42.42
  Bottom 0.813: v18.54,42.42 15.24,39.12 v9.02,39.12
N$16  (1 unrouted)
  Top 0.813: ANT2.P$2 3.94,44.78 3.94,43.43 5.71,41.66 9.02,41.66 9.91,40.77 9.91,40.26 10.67,39.5 K2.8
N$17
  Top 0.305: IC6.16 34.04,38.86 CDC2.1
  Top 0.406: 34.29,38.92 CDC2.1
N$18
  Top 0.406: IC6.9 33.33,30.03 CDEC.2
N$19
  Top 0.406: CDEC.1 30.86,28.32 29.97,29.21 29.97,30.48 30.73,31.24
  Top 0.61: 30.73,31.24 IC6.10
N$20
  Top 0.813: IC6.3 24.92,36.32 R7.2
N$23
  Top 0.406: T1_VDIV.3 17.53,18.59 VDIV2.2
N$26
  Top 0.813: U$3.7 33.78,13.12 L2.1
N$27
  Top 0.813: U$3.1 35.05,22.1 C_BST.2 37.59,21.97 38.49,21.07 L1.P$2
N$30  (1 unrouted)
  Top 0.813: K2.6 15.75,39.5 15.49,39.75 15.49,42.8 12.95,45.34 12.95,47.88 12.45,48.39 10.41,48.39 8.53,50.27 ANT2.P$3
N$32
  Top 0.406: U2.4 20.45,40.3 20.45,42.29 19.3,43.43 19.3,45.47 | 19.3,45.47 K1.1 | K1.3 15.7,45.47 19.3,45.47
N$35  (1 unrouted)
  Top 0.813: ANT1.P$4 1.93,43.16 4.32,40.77 SJ2.1 | K1.6 12.01,43.16 ANT1.P$3
PA00_XIN32
  Top 0.254: IC2.1 53.26,33.23 53.26,30.8 Y4.P$1 53.06,29.24 C23.2
PA01_XOUT32
  Top 0.254: IC2.2 53.76,33.74 56.23,31.27 Y4.P$2 56.16,29.11 C24.2
PA02_AIN0  (via drill 0.61 pad 0.25)
  Top 0.254: IC2.3 54.02,34.24 56.26,32 59.31,32 59.31,9.65 54.36,4.7 52.7,4.7 50.8,2.79 TP_A0.X
  Top 0.305: VDIV2.1 VDIV1.2 VDIV_USB.1 21.97,20.83 v21.59,21.21
  Bottom 0.305: v21.59,21.21 21.59,9.4 23.5,7.49 26.8,7.49 27.3,6.99 35.94,6.99 38.61,4.32 49.02,4.32 TP_A0.X
PA03_AREFA
  Top 0.254: IC2.4 52.38,34.74 52.07,35.05 52.07,38.73 55.04,41.7 C5.+ 57.39,41.4 C4.1 64.77,47.15 64.77,51.69 63.63,52.83 25.91,52.83 TP_AREF.X
  Bottom 0.305: TP_AREF.X 23.92,50.76
PA04_AIN4
  Top 0.254: IC2.9 59.28,37.24 60.83,35.69 60.83,8.51 58.42,6.1 TP_A3.X
  Top 0.305: TP_A3.X 58.37,2.59
PA05_AIN5
  Top 0.254: IC2.10 59.54,37.74 61.34,35.94 61.34,2.92 AD.5
PA06_AIN6  (via drill 0.61)
  Top 0.305: v55.75,38.73 55.31,38.29 55.26,38.24 IC2.11
  Bottom 0.305: IOH.1 41.78,50.8 43.69,48.9 45.59,48.9 53.98,40.51 54.74,40.51 55.5,39.75 55.5,38.99 v55.75,38.73
PA7_RF_SWTICH  (via drill 0.61)
  Top 0.254: IC2.12 53.6,38.74 v54.23,39.37
  Top 0.406: K2.1 12.24,34.67 13.97,34.67 | 13.97,34.67 v16.51,34.67 | U2.2 22.35,43.56 v22.61,43.81 | K2.3 15.75,32.89 13.97,34.67
  Bottom 0.305: v22.61,43.81 22.61,45.47 25.78,48.64 36.7,48.64 37.34,48.01 38.35,48.01 39.12,48.77 IOH.2 40.64,49.28 42.42,49.28 43.43,48.26 45.34,48.26 v54.23,39.37
  Bottom 0.406: v16.51,34.67 19.43,34.67 20.83,36.07 20.83,37.59 22.61,39.37 v22.61,43.81
PA08_TCC0-W0_PA8
  Top 0.254: IC2.13 51.82,40.27 54.99,43.43 54.99,48.64 55.63,49.28 56.9,49.28 IOL.3
PA09_TCC0-W1_PA9
  Top 0.254: IC2.14 51.22,40.81 51.44,41.02 51.82,41.02 54.36,43.56 54.36,48.9 55.88,50.42 IOL.4
PA10_MISO
  Bottom 0.254: TP_12.X 31.48,50.81
  Bottom 0.305: 31.48,50.81 31.46,50.79
PA10_TCC0-W2_PA10
  Top 0.254: IC2.15 50.72,41.07 51.31,41.66 51.69,41.66 53.85,43.81 53.85,49.15 54.61,49.91 54.61,51.44 55.5,52.32 59.44,52.32 IOL.2
  Bottom 0.305: 60.91,50.74 IOL.2
PA11_TCC0-W3_PA11
  Top 0.254: IC2.16 50.22,39.44 50.55,39.12 51.69,39.12 52.58,40.01 52.58,40.26 55.63,43.31 55.63,48.39 56.01,48.77 57.28,48.77 57.78,49.28 61.98,49.28 IOL.1
  Bottom 0.305: 63.57,50.73 IOL.1
PA13
  Top 0.254: IC2.22 47.22,39.6 46.86,39.24 46.1,39.24 45.72,39.62 IOL.8
PA14_TCC0-W4
  Top 0.254: IC2.23 46.72,45.96 49.91,49.15 51.69,49.15 IOL.5
PA15_TCC0-W5
  Top 0.254: IC2.24 46.2,40.28 46.2,46.2 IOL.6
PA16_MOSI
  Top 0.305: IC2.25 44.7,47.38 42.93,49.15 42.93,51.69 42.29,52.32 35.56,52.32 TP_MOSI.X
PA17_SCK  (via drill 0.61)
  Top 0.254: IC2.26 44.69,38.23 | 44.68,38.23 IC2.26 | v37.85,49.15 38.1,48.9 42.29,48.9 44.07,47.12 44.07,39.5 43.69,39.12 43.69,38.73 44.18,38.24 IC2.26
  Bottom 0.305: v37.85,49.15 37.72,49.28 30.48,49.28 TP_SCK.X
PA18_SS
  Top 0.254: IC2.27 43.92,37.74 43.18,38.48 43.18,39.5 43.56,39.88 43.56,46.86 42.16,48.26 38.61,48.26 38.35,48.01 37.34,48.01 36.58,48.77 TP_10.X
  Bottom 0.254: 36.53,50.75 TP_10.X
PA19_MISO
  Top 0.254: IOH.5 31.5,50.04 32.26,49.28 35.18,49.28 37.08,47.37 38.73,47.37 38.99,47.62 42.04,47.62 43.05,46.61 43.05,40.13 42.67,39.75 42.67,38.23 43.66,37.24 IC2.28
PA20_TCC0-W6
  Top 0.254: IC2.29 44.71,36.73 45.44,36.73 45.72,37.01 45.72,38.86 45.21,39.37 45.21,47.62 44.45,48.39 44.45,51.56 45.21,52.32 46.74,52.32 IOL.7
PA21_INT&SDCS  (via drill 0.61 pad 0.61)
  Top 0.254: IC2.30 43.9,36.24 42.16,37.97 42.16,40.39 42.55,40.77 42.55,43.81 R9.1
  Top 0.305: v38.23,44.32 IC5.7
  Top 0.406: R9.1 IC5.7
  Bottom 0.305: U$4.1 25.99,32.05 22.99,35.05 22.99,37.97 23.62,38.61 28.07,38.61 29.46,40.01 33.15,40.01 37.47,44.32 v38.23,44.32
PA22_SDA  (via drill 0.61)
  Top 0.254: IC2.31 43.63,35.74 41.4,37.97 R13.1 41.27,40.64 v41.15,40.51 40.06,41.47 IC5.5 | v37.97,46.35 33.66,48.64 32,48.64 31.37,49.28 22.86,49.28 TP_SDA.X
  Bottom 0.254: v41.15,40.51 41.15,43.18 v37.97,46.35
PA23_SCL
  Top 0.254: TP_SCL.X 20.95,48.64 30.99,48.64 31.62,48.01 32.64,48.01 34.16,46.48 36.2,46.48 37.34,45.34 37.34,43.69 38.23,42.8 | 38.23,42.8 38.23,41.66 40.39,39.5 40.39,37.59 R12.1 41.91,36.7 43.37,35.24 IC2.32 | IC5.6 38.48,43.05 38.23,42.8
PA27_TX_LED
  Top 0.305: IC2.39 47.22,28.42 45.34,26.54 42.42,26.54 41.4,25.53 37.97,25.53 35.43,22.99 32.89,22.99 32.64,22.73 25.78,22.73 24.38,21.34 23.24,21.34 21.97,22.61 20.57,22.61 20.19,22.23 16.38,22.23 13.59,19.43 13.59,16 14.99,14.61 14.99,11.94 12.32,9.27 12.32,5.71 10.03,3.43 R6.2
PA28_2FETS  (via drill 0.61)
  Top 0.305: IC2.41 48.22,27.77 44.96,24.51 v39.24,24.51 | v36.96,31.24 38.42,32.96 T_SD.1 | T1_VDIV.1 14.86,16.62 v14.86,18.67
  Bottom 0.305: v39.24,24.51 38.1,23.37 24.64,23.37 24.38,23.62 21.84,23.62 16.89,18.67 v14.86,18.67
  Bottom 0.406: v36.96,31.24 36.96,26.8 v39.24,24.51
PA30_SWCLK
  Top 0.254: IC2.45 50.22,25.34 R4.1
PA31_SWDIO
  Top 0.254: 50.72,22.91 R3.2 51.18,22.86 51.94,23.62 51.94,25.15 50.72,26.37 IC2.46
PB02  (via drill 0.61)
  Top 0.254: IC2.47 51.22,26.89 52.32,25.78 55.12,25.78 v56.26,24.64 | v62.61,23.37 61.85,22.61 61.85,4.19 AD.6
  Bottom 0.254: v56.26,24.64 61.34,24.64 v62.61,23.37
PB03_RFIDIN  (via drill 0.61)
  Top 0.305: IC2.48 51.72,34.39 51.05,35.05 v51.05,35.56 | IC6.13 33.02,35.05 33.78,35.81 v34.42,35.81
  Bottom 0.305: v34.42,35.81 35.18,35.05 38.61,35.05 39.75,36.2 50.42,36.2 v51.05,35.56
PB08_AIN2
  Top 0.254: IC2.7 58.75,36.24 59.82,35.18 59.82,9.27 53.34,2.79 TP_A1.X
  Top 0.305: TP_A1.X 53.37,2.56
PB09_AIN3
  Top 0.254: IC2.8 59.02,36.74 60.33,35.43 60.33,8.89 55.88,4.45 TP_A2.X
PB10_S4_SPI_MOSI  (via drill 0.61)
  Top 0.305: v47.12,38.23 47.62,38.23 48.72,39.32 IC2.19
  Bottom 0.305: 27.35,29.55 U$4.2 28.53,29.55 32.77,33.78 32.77,35.69 34.92,37.85 43.56,37.85 44.58,38.86 46.35,38.86 46.99,38.23 v47.12,38.23 51.18,38.23 53.21,36.2 59.82,36.2 64.9,31.11 64.9,29.84 66.17,28.57 ICSP.4
PB11_S4_SPI_SCK  (via drill 0.61)
  Top 0.254: IC2.20 48.22,41.26 47.8,41.68 47.8,45.11 48.92,46.23 v52.07,46.23 | 62.48,36.83 62.48,29.08 ICSP.3
  Top 0.305: 62.48,36.83 61.98,37.34 v61.98,42.04
  Bottom 0.305: v61.98,42.04 57.78,46.23 v52.07,46.23
  Bottom 0.406: ICSP.3 59.05,27.94 57.02,25.91 47.12,25.91 43.26,22.05 U$4.5
PB12_S4_SPI_MISO  (via drill 0.61)
  Top 0.254: IC2.21 47.72,40.92 47.28,41.36 47.28,45.69 49.34,47.75 v52.07,47.75 | 63.12,30.99 ICSP.1
  Top 0.305: 63.12,30.99 63.12,37.21 62.74,37.59 62.74,40.39 63.12,40.77 v63.12,43.81
  Bottom 0.254: 63.12,43.94 v63.12,43.81
  Bottom 0.305: v52.07,47.75 59.18,47.75 v63.12,43.81 | U$4.7 39.14,17.05 47.37,25.27 57.28,25.27 59.18,27.18 62.36,27.18 62.87,26.67 64.26,26.67 64.9,27.3 64.9,28.96 63.63,30.23 ICSP.1
PB22_DEBUG_TX
  Top 0.305: IC2.37 46.22,31.23 45.21,30.23 43.81,30.23 J1.2
PB23_DEBUG_RX
  Top 0.305: IC2.38 46.72,30.59 J1.1
RESET  (via drill 0.61)  (1 unrouted)
  Top 0.305: 43.05,23.5 45.59,20.95 48.51,20.95 55.12,14.35 v58.04,14.35
  Top 0.406: R2.2 43.05,23.5 | RESET.3 26.75,0.76 31.24,0.76 TP_RESET.X
  Top 0.61: 33.02,5.82 D2.A | D2.A 32.78,7.09 31.77,8.11 R1.1 | TP_RESET.X 33.02,5.58 D2.A
  Top 0.813: v37.72,7.24 34.14,7.22 D2.A
  Bottom 0.406: ICSP.5 63.75,25.27 63.75,24.64 64.52,23.88 65.15,23.88 67.31,21.59 67.31,16.13 66.64,15.46 CN2.10 65.53,15.02 64.86,14.35 v58.04,14.35 50.93,7.24 v37.72,7.24
SWCLK  (via drill 0.61)
  Top 0.254: R4.2 54.1,24.51 v54.36,24.64
  Bottom 0.305: CN2.4 66.26,19.27 66.67,19.68 66.67,21.34 65.53,22.48 63.5,22.48 62.48,21.46 57.53,21.46 v54.36,24.64
SWDIO  (via drill 0.61)
  Top 0.254: R3.1 v54.23,22.86
  Bottom 0.305: CN2.2 65.53,20.95 64.77,21.72 63.63,21.72 62.74,20.83 57.28,20.83 55.24,22.86 v54.23,22.86
TARGET_RESET
  Top 0.305: R2.1 C8.1 45.09,25.4 47.72,28.04 IC2.40
TARGET_USB_N
  Top 0.254: U$5.D- 9.52,25.4 14.22,25.4 | 14.22,25.4 26.04,25.4 arc47 37.21,29.72 40.64,33.53 arc-54 42.67,34.74 IC2.33 | Z6.1 14.22,26.45 14.22,25.4
TARGET_USB_P
  Top 0.254: IC2.34 IC2.34 arc90 IC2.34 | 44.62,34.24 IC2.34 | U$5.D+ 14.22,24.64 | 14.22,24.64 26.92,24.64 arc50 38.23,29.72 41.27,33.15 arc-58 43.56,34.24 IC2.34 | Z5.1 14.22,23.58 14.22,24.64
VBAT1  (via drill 0.61)  (1 unrouted)
  Top 0.254: IC5.3 33.72,42.99
  Top 0.406: 33.72,42.99 32.38,41.66 24.89,41.66 24.26,42.29 24.26,44.07 22.86,45.47 v21.34,45.47
  Bottom 0.406: v21.34,45.47 15.11,45.47 G1.+@1
VDD  (via drill 0.61)
  Top 0.61: v34.8,30.35 35.69,31.24 35.69,33.48 T_SD.3
  Bottom 0.61: v34.8,30.35 33.91,30.35 28.1,24.55 U$4.4
VDDCORE
  Top 0.254: IC2.43 49.22,27 47.37,25.14 C19.1
X3.3V  (3 unrouted)
XUSB  (via drill 0.61)  (4 unrouted)
  Top 0.406: 21.46,17.4 19.94,17.4 v19.05,16.51
  Top 0.508: v12.57,26.92 12.61,27.59 C26.1
  Top 0.61: U$5.VBUS 11.89,26.24 v12.57,26.92
  Bottom 0.305: v19.05,16.51 12.57,16.51
  Bottom 0.61: v12.57,26.92 12.57,16.51 12.57,8.66

### Text on the board
tPlace: SCK | PA17 | MISO | PA10 | PA23 | PA22 | PA03 | MOSI | PA16 | SS | PA18 | GPIO3 | PA7 | GPIO2 | PA6 | PA13 | PA20 | PA15 | PA14 | PA9 | PA8 | PA10 | 0
tNames: DIGITAL | SCL | SDA | AREF | GND | 1 | IOREF | RESET | 3V3 | 5V | GND | VIN | PA2 | PB08 | PB09 | PB04 | PB05 | PB02
bNames: designed by | tinker it
ReferenceLC: ON
214bmp: D:/SmartProjects/Snc/a4_bn_logo2.bmp